# EAGLE design source_eagle (EAGLE 9.6.2)
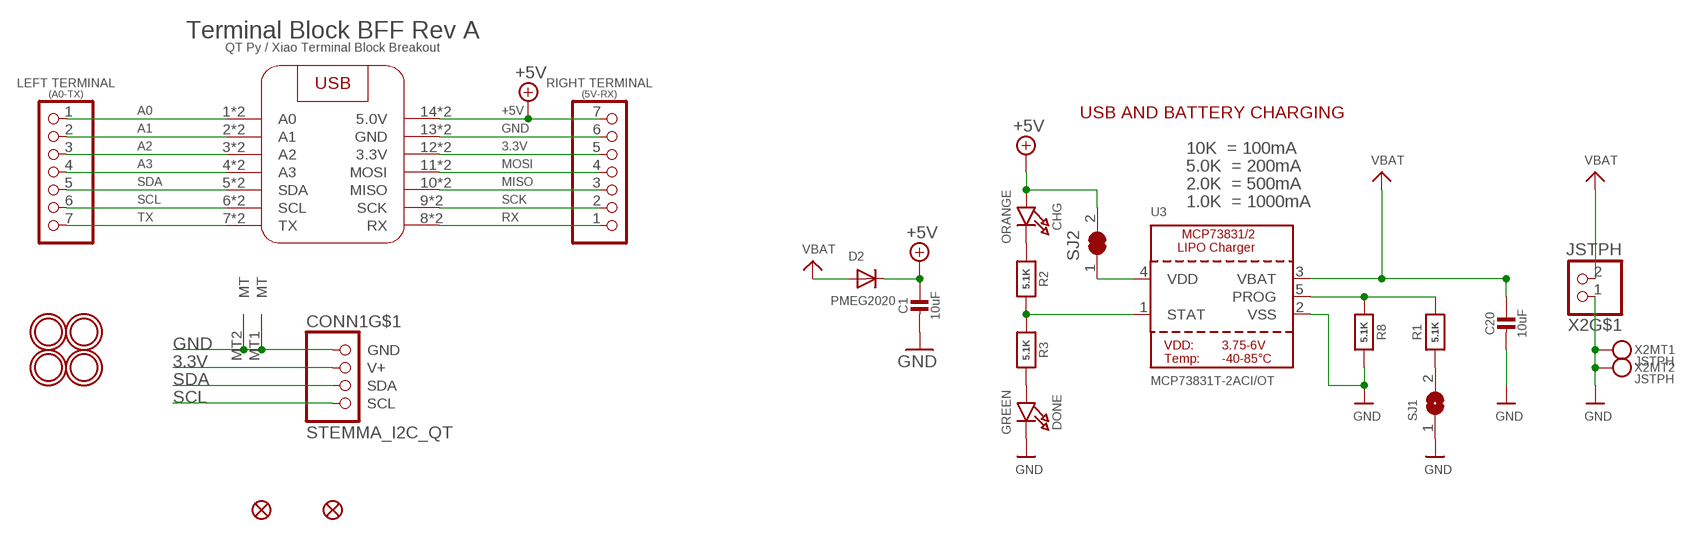
[diagram p0: schematic, sheet 1]

## Parts
C1  10uF  CAP_CERAMIC0805-NOOUTLINE  [0805-NO]
C20  10uF  CAP_CERAMIC0805-NOOUTLINE  [0805-NO]
CHG  ORANGE  LED0603_NOOUTLINE  [CHIPLED_0603_NOOUTLINE]
CONN1  STEMMA_I2C_QT  [JST_SH4]
D2  PMEG2020  DIODE_SOD-123FL  [SOD-123FL]
DONE  GREEN  LED0603_NOOUTLINE  [CHIPLED_0603_NOOUTLINE]
FID1  FIDUCIAL_0.5MM  [FIDUCIAL_0.5MM]
FID2  FIDUCIAL_0.5MM  [FIDUCIAL_0.5MM]
JP1  Terminal  HEADER-1X7_2.54MMTERM  [1X07_2.54MMTERMINAL]
JP2  Terminal  HEADER-1X7_2.54MMTERM  [1X07_2.54MMTERMINAL]
R1  5.1K  RESISTOR_0402NO  [_0402NO]
R2  5.1K  RESISTOR_0402NO  [_0402NO]
R3  5.1K  RESISTOR_0402NO  [_0402NO]
R8  5.1K  RESISTOR_0402NO  [_0402NO]
SJ1  SOLDERJUMPER  [SOLDERJUMPER_ARROW_NOPASTE]
SJ2  SOLDERJUMPER_CLOSED  [SOLDERJUMPER_CLOSEDWIRE]
U3  MCP73831T-2ACI/OT  MCP73831/2  [SOT23-5]
U$1  MOUNTINGHOLE2.5  [MOUNTINGHOLE_2.5_PLATED]
U$2  MOUNTINGHOLE2.5  [MOUNTINGHOLE_2.5_PLATED]
U$3  MOUNTINGHOLE2.5  [MOUNTINGHOLE_2.5_PLATED]
U$4  MOUNTINGHOLE2.5  [MOUNTINGHOLE_2.5_PLATED]
X1  QTPY_SOCKET_DUAL_SMT  [QTPY_SMT]
X2  JSTPH  CON_JST_PH_2PIN_MT_BATT  [JSTPH2_BATT]

## Nets
3.3V [power]: CONN1.2(V+) JP1.5 X1.12(3.3V) X1.12B(3.3V)
+5V [power]: C1.1 CHG.A D2.C JP1.7 SJ2.2 X1.14(5.0V) X1.14B(5.0V)
A0: JP2.1 X1.1(A0) X1.1B(A0)
A1: JP2.2 X1.2(A1) X1.2B(A1)
A2: JP2.3 X1.3(A2) X1.3B(A2)
A3: JP2.4 X1.4(A3) X1.4B(A3)
GND [power]: C1.2 C20.2 CONN1.1(GND) CONN1.MT1(MT) CONN1.MT2(MT) DONE.C JP1.6 R8.2 SJ1.1 U3.2(VSS) X1.13(GND) X1.13B(GND) X2.1 X2.NC1 X2.NC2
MISO: JP1.3 X1.10(MISO) X1.10B(MISO)
MOSI: JP1.4 X1.11(MOSI) X1.11B(MOSI)
N$1: R1.1 SJ1.2
N$2: CHG.C R2.1
N$3: R2.2 R3.1 U3.1(STAT)
N$4: R1.2 R8.1 U3.5(PROG)
N$5: DONE.A R3.2
N$6 [power]: SJ2.1 U3.4(VDD)
RX: JP1.1 X1.8(RX) X1.8B(RX)
SCK: JP1.2 X1.9(SCK) X1.9B(SCK)
SCL: CONN1.4(SCL) JP2.6 X1.6(SCL) X1.6B(SCL)
SDA: CONN1.3(SDA) JP2.5 X1.5(SDA) X1.5B(SDA)
TX: JP2.7 X1.7(TX) X1.7B(TX)
VBAT [power]: C20.1 D2.A U3.3(VBAT) X2.2

## Notes on the sheet
- Terminal Block BFF Rev A
- QT Py / Xiao Terminal Block Breakout
- LEFT TERMINAL | RIGHT TERMINAL
- (A0-TX) | (5V-RX)
- USB AND BATTERY CHARGING
- 10K  = 100mA
- 5.0K  = 200mA
- 2.0K  = 500mA
- 1.0K  = 1000mA

## Library data of the parts
C1 C20 = microbuilder:CAP_CERAMIC: Ceramic Capacitors For new designs, use the packages preceded by an '_' character since they are more reliable: The following footprints should be used on most boards: _0402 - Standard footprint for regular board layouts _0603 - Standard footprint for regular board layouts _0805 - Standard footprint for regular board layouts _1206 - Standard footprint for regular board layouts For extremely tight-pitch boards where space is at a premium, the following 'micro-pitch' footprints can be used (smaller pads, no silkscreen outline, etc.): _0402MP - Micro-pitch footprint for very dense/compact boards _0603MP - Micro-pitch footprint for very dense/compact boards _0805MP - Micro-pitch footprint for very dense/compact boards _1206MP - Micro-pitch footprint for very dense/compact boards
CHG DONE = microbuilder:LED: LED 0603 - 0603 Surface Mount Package 2mA: Green LED - Low Power (3.9mcd, 2ma, 1.7Vf) - Digikey: 475-2709-2-ND Orange LED - Low Power (9.8mcd, 2ma, 1.8Vf) - Digikey: 475-1194-2-ND Red LED - Low Power (5mcd, 2ma, 1.8Vf) - Digikey: 475-1195-2-ND Yellow LED - Low Power (7mcd, 2ma, 1.8Vf) - Digikey: 475-1196-2-ND 5mA: Blue LED - Low Power (17mcd, 5ma, 2.9Vf) - Digikey: LNJ937W8CRACT-ND 0805 - 0805 Surface Mount Package 2mA: Red LED (8.8mcd, 2mA, 1.8Vf, Clear) - Low Power [Digikey: 475-2510-1-ND] Green LED (5mcd, 2mA, 1.8Vf, Clear) - Low Power [Digikey: 475-2730-1-ND] Yellow LED (11.3mcd, 2mA, 1.8Vf, Clear) - Low Power [Digikey: 475-2555-1-ND] 20mA: Red LED (104mcd, 20mA, Diffused) - LS R976 [Digikey: 475-1278-6-ND] Red LED (12mcd, 20mA, 2.0Vf, Clear) - APT2012EC [Digikey: 754-1128-1-ND] Green LED (15mcd, 20mA, 2.2Vf, Clear) - APT2012GC [Digikey: 754-1131-1-ND] Orange LED (160mcd, 20mA, 2.1Vf, Clear) - APT2012SECK [Digikey: 754-1130-1-ND] 1206 - 1206 Surface Mount Package Green LED (26mcd, 20mA, Diffused) - LG N971 [Digikey: 475-1407-6-ND] Red LED (15mcd, 20mA, Diffused) - LH N974 [Digikey: 475-1416-6-ND] Cree - Cree High-Power Surface Mount LEDs XPEBWT-L1-0000-00D50 - White 111lm 350mA 2.9Vf 6200K 110° XTEAWT-00-0000-00000LEE3 - White 114lm 350mA 2.85Vf 5000K 115° Everlight - Everlight 45-21 Series Surface Mount LEDs 45-21/QK2C-B2832AC2CB2/2T - Warm White 2000mcd 20mA 3.25Vf 3050K 120° 45-21/LK2C-B38452C4CB2/2T - Nuetral White 2000mcd 20mA 3.25Vf 4150K 120° 45-21/LK2C-B50634C6CB2/2T - Cold White 2200mcd 20mA 3.25Vf 5650K 120° PLCC2 Reverse Mount LS T77K-J1L2-1-0-2-R18-Z - Red 11.25mcd 2mA 1.8Vf 630nm 120° LO T77K-L1M2-24-Z - Orange 19.6mcd 2mA 1.8Vf 606nm 120° LY T77K-K2M1-26-Z - Yellow 15.7mcd 2mA 1.8Vf 587nm 120°; ROT: 270
CONN1 = adafruit_electromech:STEMMA_I2C; LCSC: C2845363
D2 = adafruit:DIODE: Diode SMADIODE - SMA Surface Mount Package 20V 1A Schottky Diode Digikey: 641-1014-6-ND DO-1N4148 - Through Hole Small Current Diode SOD-123 20V 1 A (.5mV Vf) Schottky Diode - Digikey: MBRX120TPMSCT-ND SOD-323 10V 570mA (.38mV Vf, 3ns) Schottky Diode - Digikey: ZLLS410CT-ND SOD-523 30V 30mA Schottky Diode (RB751S-40TE61) - Digikey: RB751S-40TE61CT-ND SOT23-R/W - SOT23 Package (R = Solder Paste/Reflow Ovens, W = Hand-Soldering) BAT54Film 40V 300mA - Digikey: 497-7162-1-ND
FID1 FID2 = microbuilder:FIDUCIAL: Fiducial Alignment Points Various fiducial points for machine vision alignment.
JP1 JP2 = microbuilder:HEADER-1X7: PIN HEADER
R1-R3 R8 = microbuilder:RESISTOR: Resistors For new designs, use the packages preceded by an '_' character since they are more reliable: The following footprints should be used on most boards: _0402 - Standard footprint for regular board layouts _0603 - Standard footprint for regular board layouts _0805 - Standard footprint for regular board layouts _1206 - Standard footprint for regular board layouts For extremely tight-pitch boards where space is at a premium, the following 'micro-pitch' footprints can be used (smaller pads, no silkscreen outline, etc.): _0402MP - Micro-pitch footprint for very dense/compact boards _0603MP - Micro-pitch footprint for very dense/compact boards _0805MP - Micro-pitch footprint for very dense/compact boards _1206MP - Micro-pitch footprint for very dense/compact boards
SJ1 = microbuilder:SOLDERJUMPER: SMD Solder JUMPER Solder the two pads together to create a connection, or remove the solder to break it. REFLOW - Use this footprint for solder paste and reflow ovens. WAVE - Use this footprint for hand-soldering (larger pads). CLOSED - Has a trace between the two pads to ensure it is closed by default. The trace needs to be cut to disable the jumper, and can be closed again by creating a solder bridge between the two pads.; BOM: EXCLUDE
SJ2 = microbuilder:SOLDERJUMPER_CLOSED: Solder Jumper - Closed These solder jumpers are closed by default CLOSEDWIRE - 10 mil trace between pads that can be cut and resoldered later CLOSEDPERM - 63 mil trace between pads for a permanent connection (used to 'bridge' two signals, a shameless hack for Eagle). Can double as a test point as well (no cream layer)
U3 = microbuilder:MCP73831/2: MCP73831/2 LIPO Charger VDD: 3.75 - 6V Temp -40 - 85°C Programmable Charge Rate: 15-500mA NOTE: STAT is a tri-state logic output on the MCP73831 and an open-drain output on the MCP73832. SOT23-5 with 4.2V output and tri-state logic on STAT = MCP73831T-2ACI/OT; JLC_ROTATION: 270; LCSC: C424093
U$1-U$4 = adafruit_electromech:MOUNTINGHOLE: Mounting Hole For #2 screws (0.086"/2.18mm width, 0.094"/2.4mm hole) use 2.5mm; BOM: EXCLUDE
X1 = microbuilder:QTPY_SOCKET
X2 = adafruit_electromech:CON_JST_PH_2PIN_MT; LCSC: C47647

## Net classes
1 power: width 0.305 mm

## Board
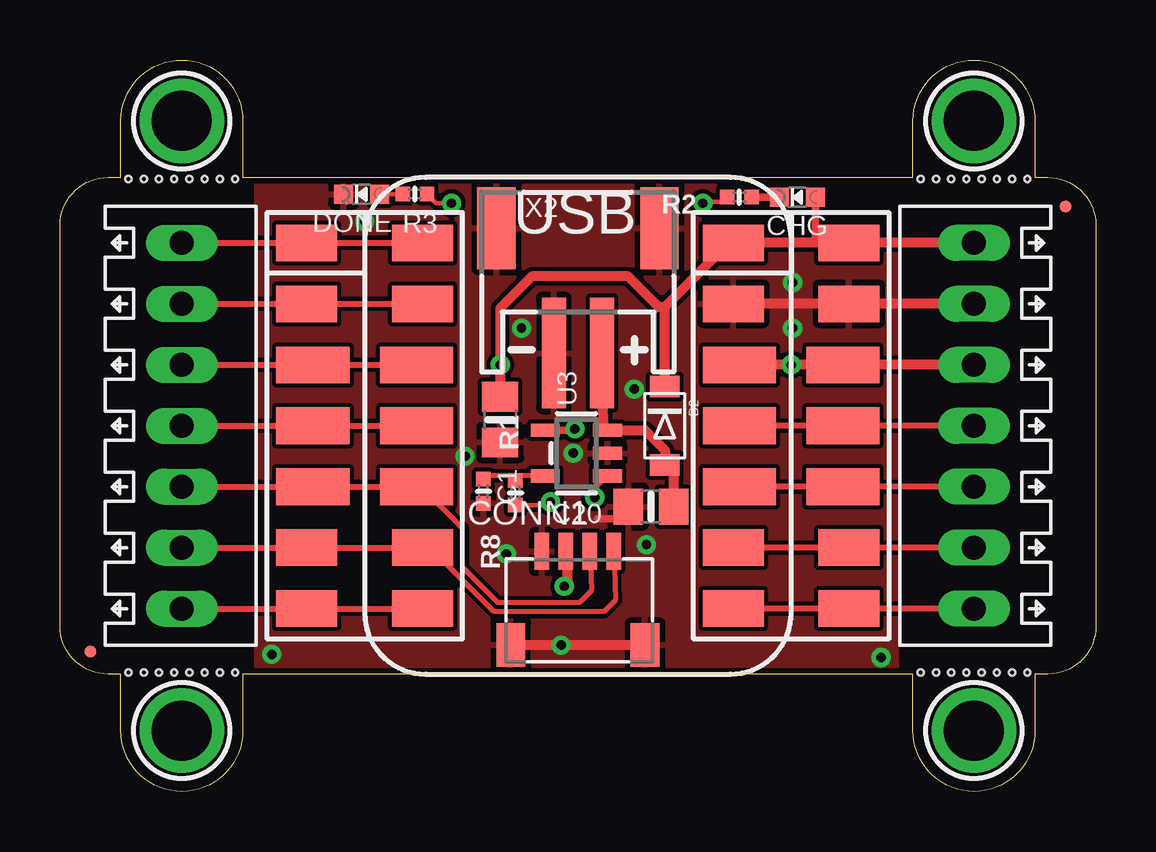
[diagram p1: board, top side]
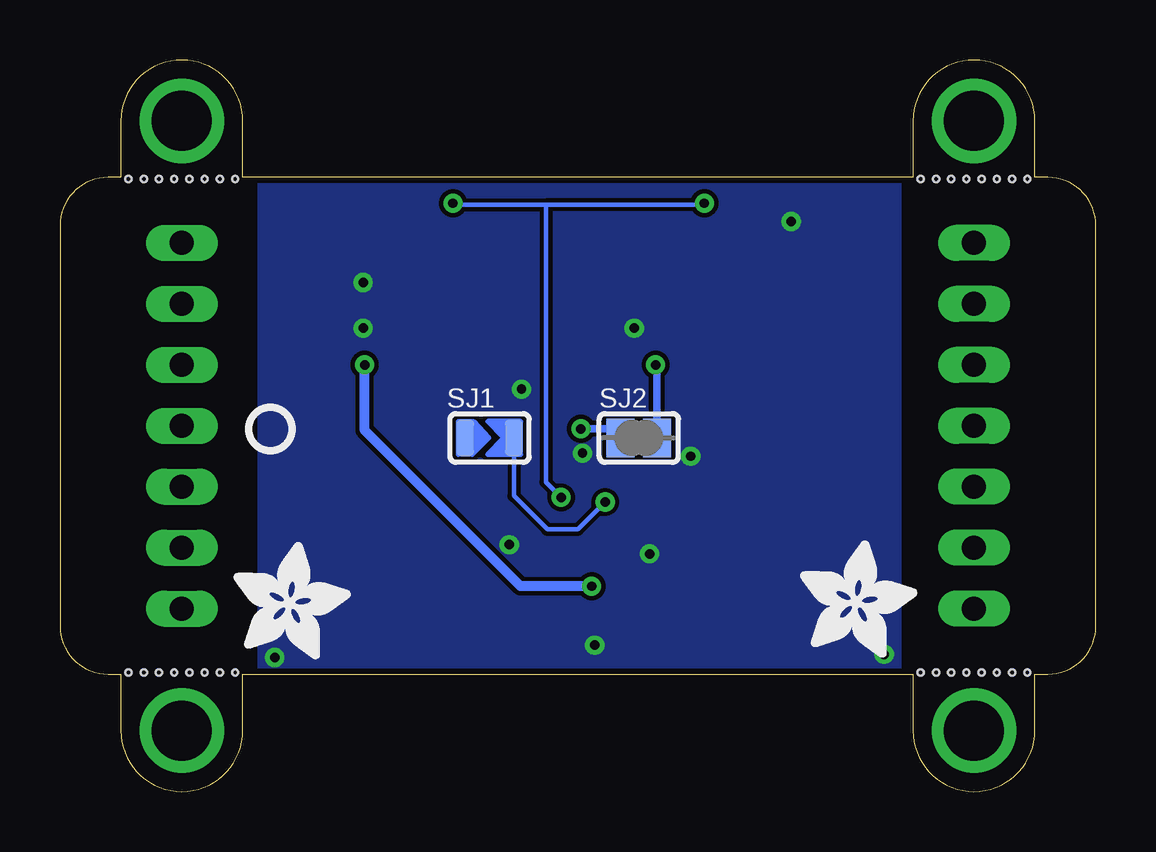
[diagram p2: board, bottom side, seen from below]

Size 43.18 x 30.48 mm. Coordinates in mm from the lower left corner, seen from the top.
Outline: 43.18,23.59 43.18,6.89 arc-90 41.18,4.89 40.64,4.89 40.64,2.54 arc-90 38.1,0 arc-90 35.56,2.54 35.56,4.89 7.62,4.89 7.62,2.54 arc-90 5.08,0 arc-90 2.54,2.54 2.54,4.89 2,4.89 arc-90 0,6.89 0,23.59 arc-90 2,25.59 2.54,25.59 2.54,27.94 arc-90 5.08,30.48 arc-90 7.62,27.94 7.62,25.59 35.56,25.59 35.56,27.94 arc-90 38.1,30.48 arc-90 40.64,27.94 40.64,25.59 41.18,25.59 arc-90 43.18,23.59
Copper layers (1*16): Top 0.035mm / dielectric 1.5mm / Bottom 0.035mm
Design rules "adafruit 7-7": minimum track width 7mil, minimum drill 15.5mil, track to track 7mil, track to pad 7mil, pad to pad 7mil, via to via 7mil, smd to smd 7mil, copper to edge 10mil, drill to drill 8mil, minimum pad ring 10mil, minimum via ring 8mil, stop-mask expansion 2mil, vias tented up to drill 20mil, thermal gap 10mil
Holes 0.25 mm at 4.76,25.53 5.4,25.53 6.03,25.53 6.67,25.53 7.3,25.53 4.13,25.53 3.49,25.53 2.86,25.53 37.78,25.53 38.42,25.53 39.05,25.53 39.69,25.53 40.32,25.53 37.15,25.53 36.51,25.53 35.88,25.53 4.76,4.95 5.4,4.95 6.03,4.95 6.67,4.95 7.3,4.95 4.13,4.95 3.49,4.95 2.86,4.95 37.78,4.95 38.42,4.95 39.05,4.95 39.69,4.95 40.32,4.95 37.15,4.95 36.51,4.95 35.88,4.95

### Footprints (pad centres in the part's own frame; a part is rotated, then mirrored left to right if it is on the bottom)
0805-NO = smd 1.24 x 1.5: 1 -0.95,0; 2 0.95,0
CHIPLED_0603_NOOUTLINE = smd 0.8 x 0.8: A 0,-0.75; C 0,0.75
JST_SH4 = smd 0.6 x 1.55: 1 -1.5,2.006; 2 -0.5,2.006; 3 0.5,2.006; 4 1.5,2.006 | smd 1.2 x 1.8: MT1 -2.8,-1.894; MT2 2.8,-1.894
SOD-123FL = smd 0.91 x 1.22: A 1.637,0; C -1.637,0
FIDUCIAL_0.5MM = smd 0.5 x 0.5: 1 0,0
1X07_2.54MMTERMINAL = drill 1 long: 1 7.62,0; 2 5.08,0; 3 2.54,0; 4 0,0; 5 -2.54,0; 6 -5.08,0; 7 -7.62,0
_0402NO = smd 0.6 x 0.6: 1 -0.508,0; 2 0.508,0
SOLDERJUMPER_ARROW_NOPASTE = smd 0.762 x 1.524: 1 -1.016,0; 2 1.016,0
SOLDERJUMPER_CLOSEDWIRE = smd 1.168 x 1.6: 1 -0.762,0; 2 0.762,0 | smd 0.635 x 0.203: WIRE 0,0
SOT23-5 = smd 0.55 x 1.2: 1 -0.95,-1.3; 2 0,-1.3; 3 0.95,-1.3; 4 0.95,1.3; 5 -0.95,1.3
MOUNTINGHOLE_2.5_PLATED = drill 2.5 pad 3.2: P$1 0,0
QTPY_SMT = smd 2.54 x 1.524: 1 2.413,17.971; 1B -2.413,17.971; 2 2.413,15.431; 2B -2.413,15.431; 6 2.413,5.271; 6B -2.413,5.271; 7 2.413,2.731; 7B -2.413,2.731; 8 15.367,2.731; 8B 20.193,2.731; 9 15.367,5.271; 9B 20.193,5.271; 13 15.367,15.431; 13B 20.193,15.431; 14 15.367,17.971; 14B 20.193,17.971 | smd 3.048 x 1.524: 3 2.159,12.89; 3B -2.159,12.89; 4 2.159,10.351; 4B -2.159,10.351; 5 2.159,7.811; 5B -2.159,7.811; 10 15.621,7.811; 10B 19.939,7.811; 11 15.621,10.351; 11B 19.939,10.351; 12 15.621,12.89; 12B 19.939,12.89
JSTPH2_BATT = smd 1 x 4.6: 1 -1,-2.049; 2 1,-2.049 | smd 1.6 x 3.4: NC1 -3.4,3.151; NC2 3.4,3.151

### Placement (x,y rotation side)
C1  18.35,15.49 270 top
C20  24.64,11.87 180 top
CHG  30.73,24.77 90 top
CONN1  21.59,8 0 top
D2  25.21,15.24 270 top
DONE  12.57,24.89 90 top
FID1  41.91,24.38 0 top
FID2  1.27,5.84 0 top
JP1  38.1,15.24 270 top
JP2  5.08,15.24 90 top
PLABEL0  [PLABEL0]  0.95,22.86 90 top
PLABEL1  [PLABEL1]  0.95,20.32 90 top
PLABEL2  [PLABEL2]  0.95,17.78 90 top
PLABEL3  [PLABEL3]  0.95,15.24 90 top
PLABEL4  [PLABEL4]  0.95,12.7 90 top
PLABEL5  [PLABEL5]  0.95,10.16 90 top
PLABEL6  [PLABEL6]  0.95,7.62 90 top
PLABEL7  [PLABEL7]  42.35,22.86 90 top
PLABEL8  [PLABEL8]  42.35,20.32 90 top
PLABEL9  [PLABEL9]  42.35,17.78 90 top
PLABEL10  [PLABEL10]  42.35,15.24 90 top
PLABEL11  [PLABEL11]  42.35,12.7 90 top
PLABEL12  [PLABEL12]  42.35,10.16 90 top
PLABEL13  [PLABEL13]  42.35,7.62 90 top
PLABEL14  [PLABEL14]  25.34,5.14 0 top
PLABEL15  [PLABEL15]  31.94,24.32 0 top
PLABEL16  [PLABEL16]  8.13,24.45 0 top
PLABEL17  [PLABEL17]  21.59,18.8 0 bottom
PLABEL18  [PLABEL18]  21.59,11.81 0 bottom
PLABEL19  [PLABEL19]  30.29,14.73 0 bottom
PLABEL20  [PLABEL20]  21.59,22.73 0 bottom
PLABEL21  [PLABEL21]  21.59,7.18 0 bottom
PLABEL22  [PLABEL22]  3.3,22.86 0 bottom
PLABEL23  [PLABEL23]  3.3,20.32 0 bottom
PLABEL24  [PLABEL24]  3.3,17.78 0 bottom
PLABEL25  [PLABEL25]  3.3,15.24 0 bottom
PLABEL26  [PLABEL26]  3.3,12.7 0 bottom
PLABEL27  [PLABEL27]  3.3,10.16 0 bottom
PLABEL28  [PLABEL28]  3.3,7.62 0 bottom
PLABEL29  [PLABEL29]  39.88,22.86 0 bottom
PLABEL31  [PLABEL31]  39.88,17.78 0 bottom
PLABEL32  [PLABEL32]  39.88,15.24 0 bottom
PLABEL33  [PLABEL33]  39.88,12.7 0 bottom
PLABEL34  [PLABEL34]  39.88,10.16 0 bottom
PLABEL35  [PLABEL35]  39.88,7.62 0 bottom
PLABEL36  [PLABEL36]  21.59,24.7 0 bottom
PLABEL37  [PLABEL37]  39.88,20.32 0 bottom
PLABEL38  [PLABEL38]  11.81,14.86 0 bottom
R1  18.99,12.45 90 top
R2  28.32,24.77 180 top
R3  14.8,24.89 180 top
R8  17.65,12.51 270 top
SJ1  25.27,14.73 0 bottom
SJ2  19.05,14.73 0 bottom
U3  21.53,14.1 90 top
U$1  5.08,27.94 0 top
U$2  38.1,2.54 0 top
U$3  5.08,2.54 0 top
U$4  38.1,27.94 0 top
U$7  [ADAFRUIT_5MM]  35.94,5.52 0 bottom
U$8  [ADAFRUIT_5MM]  12.32,5.59 0 bottom
U$9  [PCBFEAT-REV-040]  34.42,15.11 0 bottom
X1  12.7,4.89 0 top
X2  21.59,20.32 0 top

### Tracks (layer width: path | path; a pad name or v marks a point on that pad's centre or on a via)
3.3V  (via drill 0.39)
  Top 0.406: JP1.5 X1.12B X1.12 v30.48,17.78 | CONN1.2 21.16,8.7 v21.02,8.55
  Bottom 0.406: v21.02,8.55 23.98,8.55 30.48,15.05 v30.48,17.78
+5V  (via drill 0.39)
  Top 0.305: CHG.A 31.48,22.86 X1.14
  Top 0.406: JP1.7 X1.14B X1.14 27.88,22.86 25.21,20.19 | D2.C 25.21,20.19 | 25.21,20.19 24.95,20.19 23.68,21.46 19.68,21.46 18.35,20.13 v18.35,17.78 C1.1
  Bottom 0.305: SJ2.2 18.29,17.72 v18.35,17.78
A0
  Top 0.254: JP2.1 X1.1B X1.1
A1
  Top 0.254: JP2.2 X1.2B X1.2
A2
  Top 0.254: JP2.3 X1.3B X1.3
A3
  Top 0.254: JP2.4 X1.4B X1.4
GND  (via drill 0.39)
  Top 0.305: C20.2 23.18,11.37 22.42,11.37
  Top 0.406: JP1.6 X1.13B X1.13 | CONN1.MT1 CONN1.MT2
  other vias: 19.24,19.3 23.94,16.76 21.4,14.1 16.89,13.97 18.61,9.91 24.45,10.29 20.89,6.1 34.23,5.59 8.83,5.71 12.7,23.75 30.54,21.21 30.54,19.3
  pour Top: 8.19,25.53 34.86,25.53 34.86,4.83 8.19,4.83
  pour Bottom: 8.19,25.53 34.86,25.53 34.86,4.83 8.19,4.83
MISO
  Top 0.254: JP1.3 X1.10B X1.10
MOSI
  Top 0.254: JP1.4 X1.11B X1.11
N$1  (via drill 0.39)
  Top 0.178: R1.1 20.32,11.94 v20.45,12.07
  Bottom 0.178: v20.45,12.07 21.59,10.92 22.86,10.92 24.26,12.32 SJ1.2
N$2
  Top 0.305: CHG.C R2.1
N$3  (via drill 0.39)
  Top 0.178: v16.32,24.51 15.68,24.51 R3.1 | v26.8,24.51 26.8,24.58 27.62,24.58 R2.2 | U3.1 22.29,12.61 v22.29,12.26
  Bottom 0.178: v26.8,24.51 26.73,24.45 22.92,24.45 | v16.32,24.51 16.38,24.45 22.92,24.45 | 22.92,24.45 22.92,12.89 v22.29,12.26
N$4
  Top 0.178: R1.2 18.99,13.15
  Top 0.203: U3.5 18.99,13.15 17.7,13.15 R8.1
N$5
  Top 0.178: R3.2 DONE.A
N$6  (via drill 0.39)
  Top 0.305: v21.46,15.11 21.4,15.05 U3.4
  Bottom 0.305: SJ2.1 20.19,15.11 v21.46,15.11
RX
  Top 0.254: JP1.1 X1.8B X1.8
SCK
  Top 0.254: JP1.2 X1.9B X1.9
SCL
  Top 0.203: CONN1.4 23.15,7.98 22.67,7.49 18.1,7.49 15.43,10.16 14.92,10.16
  Top 0.254: JP2.6 X1.6B 14.92,10.16 X1.6
SDA
  Top 0.203: CONN1.3 22.15,8.37 21.65,7.87 18.25,7.87 16.78,9.35 16.78,10.97 15.05,12.7 14.41,12.7
  Top 0.254: JP2.5 X1.5B 14.41,12.7 X1.5
TX
  Top 0.254: JP2.7 X1.7B X1.7
VBAT
  Top 0.406: X2.2 22.65,15.22 U3.3 24.39,15.05 25.21,14.22 D2.A 25.59,13.22 C20.1

### Text on the board
Pinguin_tBackup: DON | CHG | A0 | 5V | A1 | GND | A2 | 3V | A3 | MO | SDA | MI | SCL | SCK | TX | RX | I2C
Pinguin_bBackup: ^USB^ | A0 | 3.7/4.2V LiPoly Batt ONLY! | 5V | A1 | GND | Terminal Block BFF / For QT Py / Xiao | A2 | 3V | A3 | MO | Disable | 2.54mm / 0.1" terminal / blocks plus socket header | SDA | MI | +250mA | SCL | SCK | 250mA default LiPo / charge rate | TX | RX